# Altium schematic sheet 15.SchDoc
size 420 x 297 mm
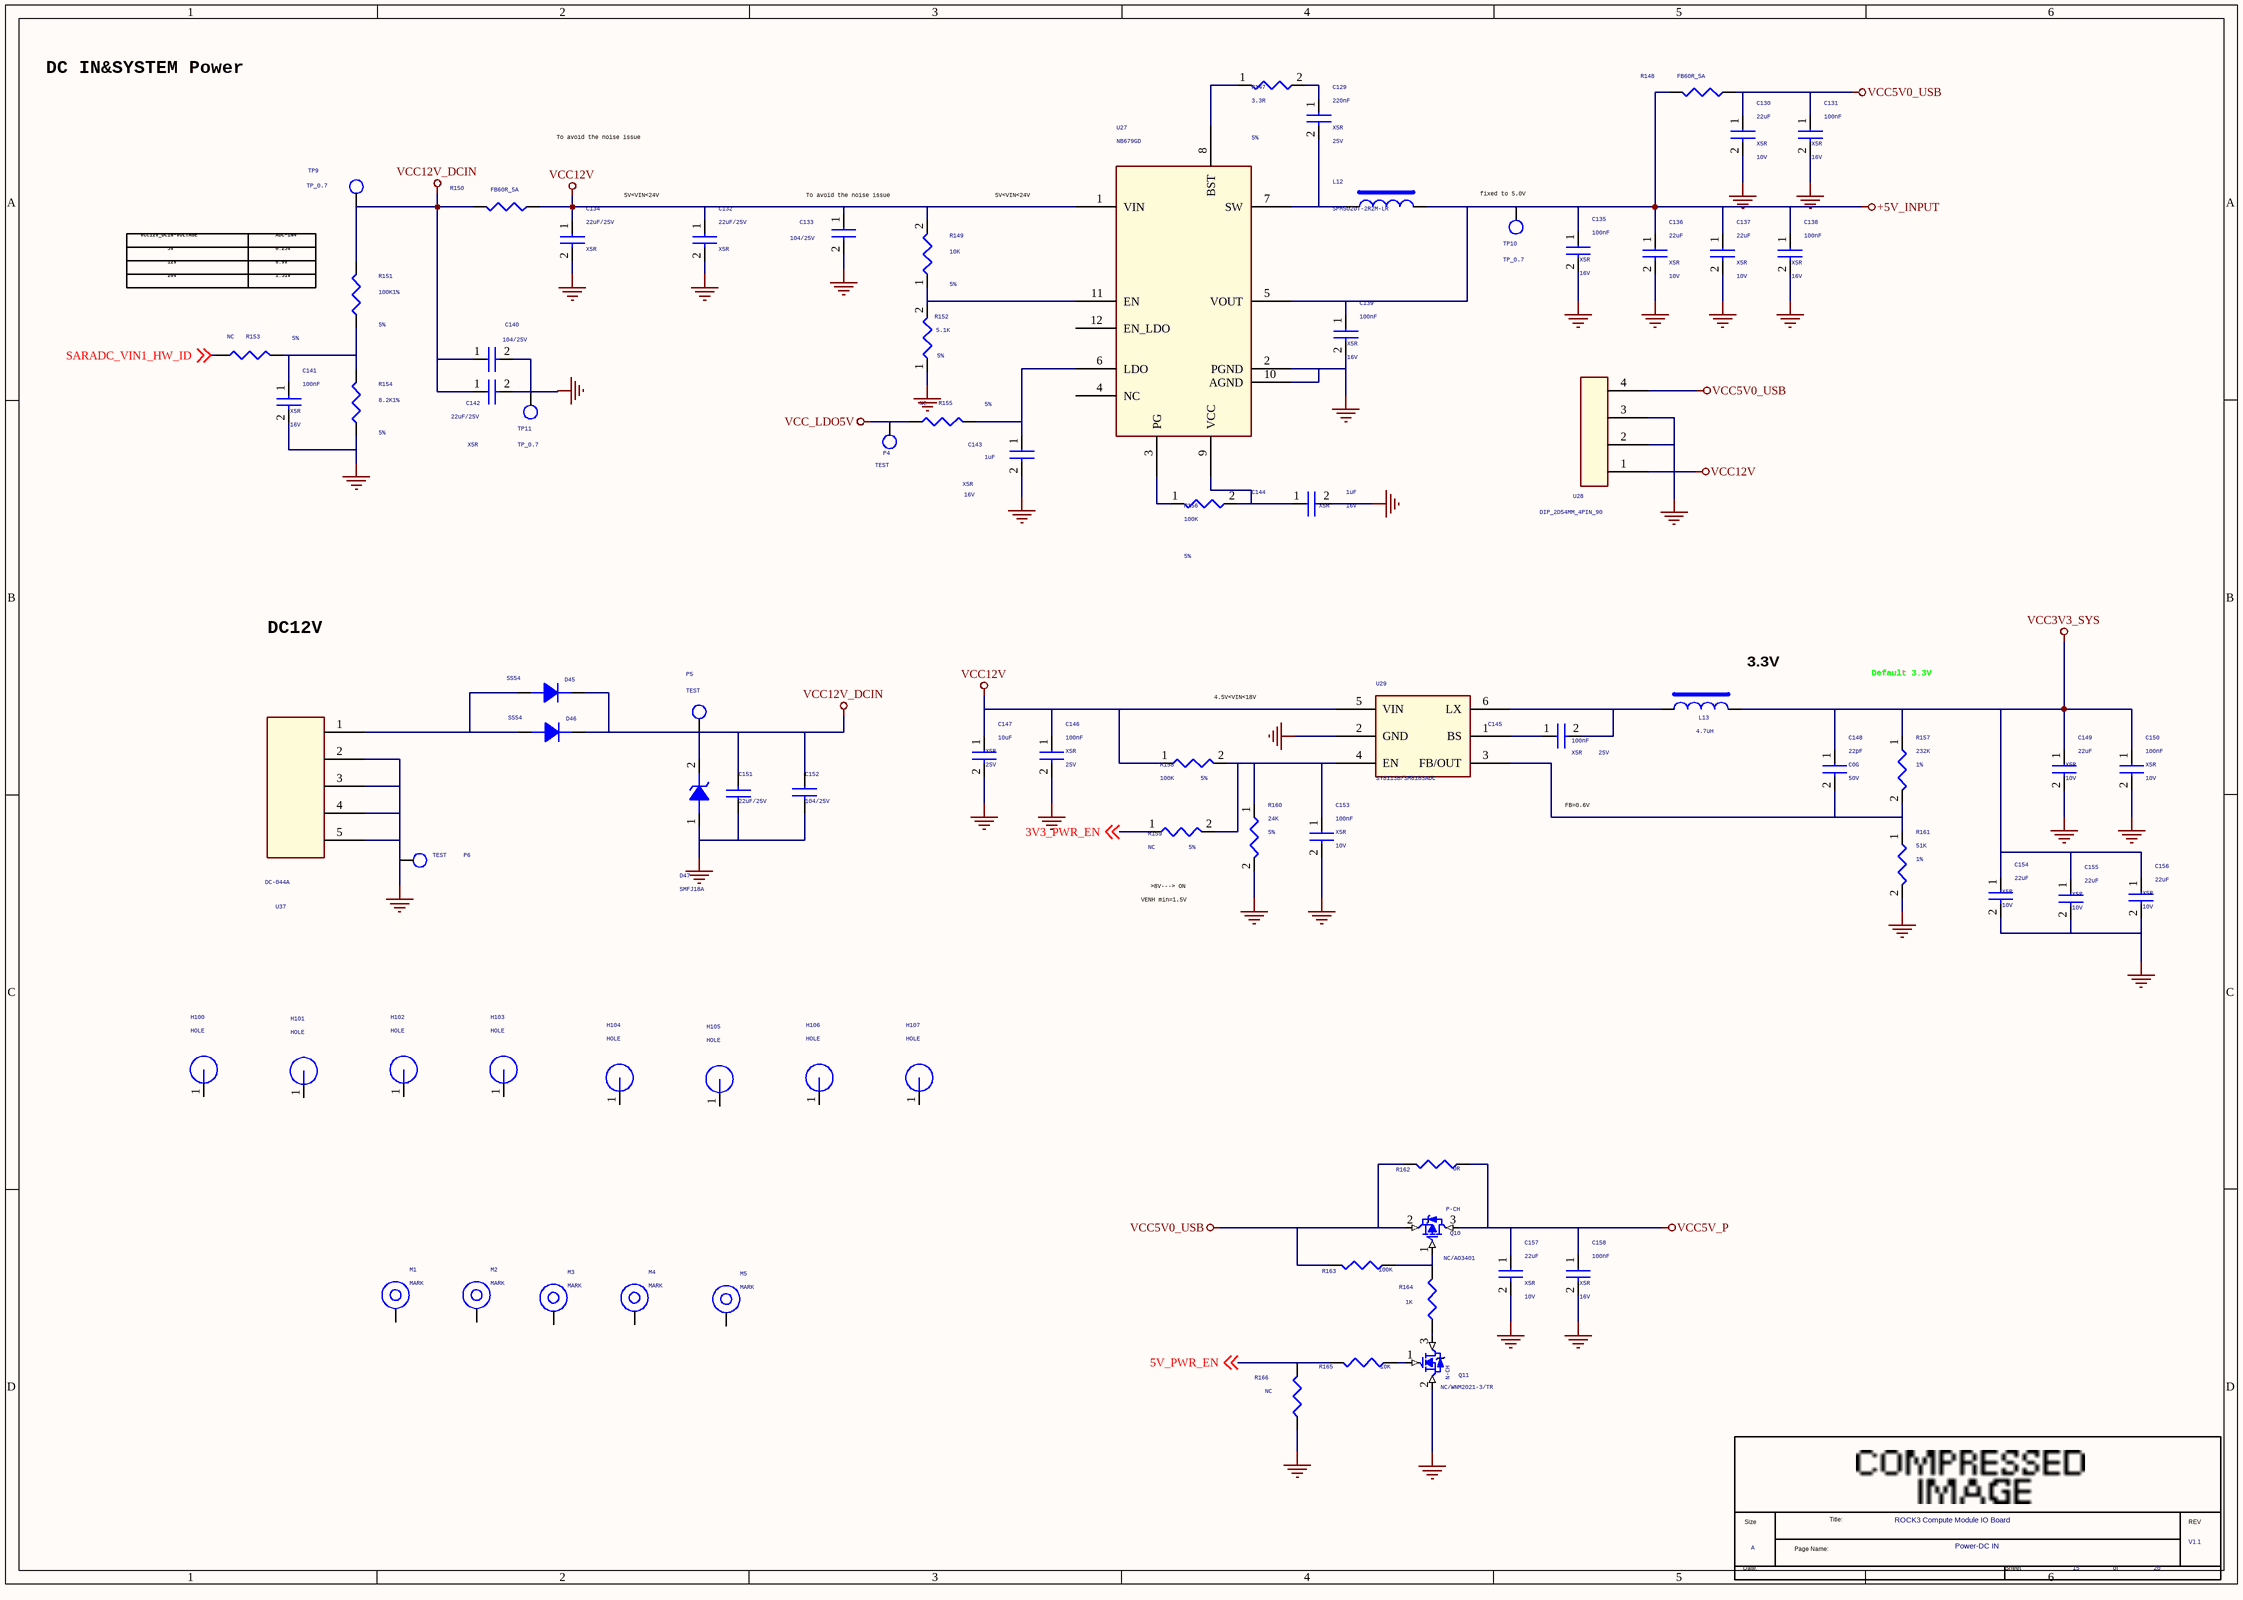
[diagram p0: 15.SchDoc]

## Parts
*  Page Count: 20  Page Number: 15  Page Size: A  Title: ROCK3 Compute Module IO Board  RevCode: V1.1  Doc: Power-DC IN  (hidden comment: radxa_gong)  (graphical)
C129  220nF  Voltage: 25V  Dielectric: X5R  [C0402]
C130  22uF  Voltage: 10V  Dielectric: X5R  [C0603]
C131  100nF  Voltage: 16V  Dielectric: X5R  [C0402]
C132  22uF/25V  Dielectric: X5R  [C0805]
C133  104/25V  [C0402]
C134  22uF/25V  Dielectric: X5R  [C0805]
C135  100nF  Voltage: 16V  Dielectric: X5R  [C0402]
C136  22uF  Voltage: 10V  Dielectric: X5R  [C0603]
C137  22uF  Voltage: 10V  Dielectric: X5R  [C0603]
C138  100nF  Voltage: 16V  Dielectric: X5R  [C0402]
C139  100nF  Voltage: 16V  Dielectric: X5R  [C0402]
C140  104/25V  [C0402]
C141  100nF  Voltage: 16V  Dielectric: X5R  [C0402]
C142  22uF/25V  Dielectric: X5R  [C0805]
C143  1uF  Voltage: 16V  Dielectric: X5R  [C0402]
C144  1uF  Voltage: 16V  Dielectric: X5R  [C0402]
C145  100nF  Voltage: 25V  Dielectric: X5R  [C0402]
C146  100nF  Voltage: 25V  Dielectric: X5R  [C0402]
C147  10uF  Voltage: 25V  Dielectric: X5R  [C1206]
C148  22pF  Voltage: 50V  Dielectric: C0G  [C0402]
C149  22uF  Voltage: 10V  Dielectric: X5R  [C0805]
C150  100nF  Voltage: 10V  Dielectric: X5R  [C0402]
C151  22uF/25V  [C0805]
C152  104/25V  [C0402]
C153  100nF  Voltage: 10V  Dielectric: X5R  [C0402]
C154  22uF  Voltage: 10V  Dielectric: X5R  [C0805]
C155  22uF  Voltage: 10V  Dielectric: X5R  [C0805]
C156  22uF  Voltage: 10V  Dielectric: X5R  [C0805]
C157  22uF  Voltage: 10V  Dielectric: X5R  [C0603]
C158  100nF  Voltage: 16V  Dielectric: X5R  [C0402]
D45  SS54  [DO_214AC]
D46  SS54  [DO_214AC]
D47  SMFJ18A  [SOD_123]
H100  HOLE  [H3.8MM]
H101  HOLE  [H3.8MM]
H102  HOLE  [H3.8MM]
H103  HOLE  [H3.8MM]
H104  HOLE  [H3.8MM]
H105  HOLE  [H3.8MM]
H106  HOLE  [H3.8MM]
H107  HOLE  [H3.8MM]
L12  SPM5020T-2R2M-LR  [IND-5020]
L13  4.7uH  [IND-5020]
M1  MARK  [MARK]
M2  MARK  [MARK]
M3  MARK  [MARK]
M4  MARK  [MARK]
M5  MARK  [MARK]
P4  TEST  [TEST]
P5  TEST  [TEST]
P6  TEST  [TEST]
Q10  NC/AO3401  [S0T-23]
Q11  NC/WNM2021-3/TR  [S0T-23]
R147  3.3R  Tolerance: 5%  [R0402]
R148  FB60R_5A  [R1206]
R149  10K  Tolerance: 5%  [R0402]
R150  FB60R_5A  [R1206]
R151  100K1%  Tolerance: 5%  [R0402]
R152  5.1K  Tolerance: 5%  [R0402]
R153  NC  Tolerance: 5%  [R0402]
R154  8.2K1%  Tolerance: 5%  [R0402]
R155  NC  Tolerance: 5%  [R0402]
R156  100K  Tolerance: 5%  [R0402]
R157  232K  Tolerance: 1%  [R0402]
R158  100K  Tolerance: 5%  [R0402]
R159  NC  Tolerance: 5%  [R0402]
R160  24K  Tolerance: 5%  [R0402]
R161  51K  Tolerance: 1%  [R0402]
R162  0R  [R0603]
R163  100K  [R0402]
R164  1K  [R0402]
R165  10K  [R0402]
R166  NC  [R0402]
TP9  TP_0.7  [TEST]
TP10  TP_0.7  [TEST]
TP11  TP_0.7  [TEST]
U27  NB679GD  [QFN12_3R00X2R00X0R90]
U28  DIP_2D54MM_4PIN_90  [XIAO_4PIN_2D54]
U29  SY8113B/SM8103ADC  [SOT_23_6]
U37  DC-044A  [DC-044A]

## Nets
+5V_INPUT: C135.1 C136.1 C137.1 C138.1 C139.1 L12.2 R148.2 TP10.1 U27.5(VOUT)
GND: C130.2 C131.2 C132.2 C133.2 C134.2 C135.2 C136.2 C137.2 C138.2 C139.2 C140.2 C141.2 C142.2 C143.2 C144.2 C146.2 C147.2 C149.2 C150.2 C151.1 C152.2 C153.2 C154.2 C155.2 C156.2 C157.2 C158.2 D47.1(ANODE) P6.1 Q11.2(S) R152.1 R154.1 R160.2 R161.2 R166.2 TP11.1 U27.2(PGND) U27.10(AGND) U28.2 U28.3 U29.2(GND) U37.2 U37.3 U37.4 U37.5
VCC3V3_SYS: C148.1 C149.1 C150.1 C154.1 C155.1 C156.1 L13.2 R157.1
VCC5V0_USB: C130.1 C131.1 Q10.2(S) R148.1 R162.2 R163.2 U28.4
VCC5V_P: C157.1 C158.1 Q10.3(D) R162.1
VCC12V: C132.1 C133.1 C134.1 C146.1 C147.1 R149.2 R150.1 R158.1 U27.1(VIN) U28.1 U29.5(VIN)
VCC12V_DCIN: C140.1 C142.1 C151.2 C152.1 D45.2(K) D46.2(K) D47.2(CATHODE) P5.1 R150.2 R151.2 TP9.1
VCC_LDO5V: P4.1 R155.1
3V3_PWR_EN: R159.1 ; off-sheet 3V3_PWR_EN
5V_PWR_EN: R165.2 R166.1 ; off-sheet 5V_PWR_EN
SARADC_VIN1_HW_ID: R153.1 ; off-sheet SARADC_VIN1_HW_ID
NetC129_1: C129.1 R147.2
NetC129_2: C129.2 L12.1 U27.7(SW)
NetC141_1: C141.1 R151.1 R153.2 R154.2
NetC143_1: C143.1 R155.2 U27.6(LDO)
NetC144_1: C144.1 R156.2 U27.9(VCC)
NetC145_1: C145.1 U29.1(BS)
NetC145_2: C145.2 L13.1 U29.6(LX)
NetC148_2: C148.2 R157.2 R161.1 U29.3(FB/OUT)
NetC153_1: C153.1 R158.2 R159.2 R160.1 U29.4(EN)
NetD45_1: D45.1(A) D46.1(A) U37.1
NetQ10_1: Q10.1(G) R163.1 R164.1
NetQ11_1: Q11.1(G) R165.1
NetQ11_3: Q11.3(D) R164.2
NetR147_1: R147.1 U27.8(BST)
NetR149_1: R149.1 R152.2 U27.11(EN)
NetR156_1: R156.1 U27.3(PG)

Not connected (* = marked no-connect by the designer): H100 1; H101 1; H102 1; H103 1; H104 1; H105 1; H106 1; H107 1; M1 1; M2 1; M3 1; M4 1; M5 1; U27 4(NC) 12(EN_LDO)

## Notes on the sheet
- DC IN&SYSTEM Power
- To avoid the noise issue
- (near TP10) fixed to 5.0V
- VCC12V_DCIN-VOLTAGE
- 5V
- 12V
- ADC-IN4
- 0.25V
- 0.9V
- 5V<VIN<24V
- (near C133) To avoid the noise issue
- 20V
- 1.51V
- DC12V
- (near L13) 3.3V
- 4.5V<VIN<18V
- Default 3.3V
- FB=0.6V
- VENH min=1.5V
- >8V---> ON
- (in symbol N-MOSFET) N-CH
- (in symbol P-MOSFET) P-CH
- (in symbol radxa_gong) Title:; Size; REV; Page Name:; Date:; Sheet; of

## Library data of the parts
C129 = CAP NP_Dup2: cap,220.00nF,+/-10%,25V,X5R,C0402; Manufacturer: TDK; RK PN: C1005X5R1E224K050BC; Priority: A; Tolerance: 10%; Part Type: C0402; Manufacturer PN: C1005X5R1E224K050BC; Created by: JJJ
C130 C136 C137 = CAP NP_Dup2: cap,22.00uF,+/-10%,10V,X5R,C0805; Manufacturer PN: C2012X5R1A226K125AB; Manufacturer: TDK; Tolerance: 10%; Priority: A; Created by: JJJ; Part Type: C0805; RK PN: C2012X5R1A226K125AB
C131 C135 C138 C139 C158 = CAP NP_Dup2: cap,100.00nF,+/-10%,16V,X5R,C0402; Manufacturer: TDK; RK PN: C1005X5R1C104K050BA; Priority: A; Tolerance: 10%; Part Type: C0402; Manufacturer PN: C1005X5R1C104K050BA; Created by: JJJ
C132 C142 = CAP NP_Dup2: cap,10.00uF,+/-10%,16V,X5R,C0805; Manufacturer PN: C2012X5R1C106K125AC; Manufacturer: TDK; Tolerance: 10%; Priority: A; Voltage: 16V; Created by: JJJ; Part Type: C0805; RK PN: C2012X5R1C106K125AC
C133 C140 = CAP NP_Dup2: cap,1.00uF,+/-10%,16V,X5R,C0402; Manufacturer: TDK; Voltage: 25V; RK PN: C1005X5R1C105K050BC; Priority: A; Tolerance: 10%; Dielectric: X5R; Part Type: C0402; Manufacturer PN: C1005X5R1C105K050BC; Created by: JJJ
C134 = CAP NP_Dup2: cap,10.00uF,+/-10%,16V,X5R,C0805; Manufacturer: TDK; RK PN: C2012X5R1C106K125AC; Priority: A; Tolerance: 10%; Voltage: 16V; Part Type: C0805; Manufacturer PN: C2012X5R1C106K125AC; Created by: JJJ
C141 = CAP NP_Dup2: cap,100.00nF,+/-10%,16V,X5R,C0402; Manufacturer PN: C1005X5R1C104K050BA; Manufacturer: TDK; Tolerance: 10%; Priority: A; Created by: JJJ; Part Type: C0402; RK PN: C1005X5R1C104K050BA
C143 C144 = CAP NP_Dup2: cap,1.00uF,+/-10%,16V,X5R,C0402; Manufacturer: TDK; RK PN: C1005X5R1C105K050BC; Priority: A; Tolerance: 10%; Part Type: C0402; Manufacturer PN: C1005X5R1C105K050BC; Created by: JJJ
C145 = CAP NP_Dup2: cap,100.00nF,+/-10%,25V,X5R,C0402; Manufacturer: TDK; Number: 37; RK PN: C1005X5R1E104K050BC; Priority: A; Tolerance: 10%; C_Voltage: 6.3V; Part Type: C0402; Manufacturer PN: C1005X5R1E104K050BC; Created by: JJJ
C146 = CAP NP_Dup2: cap,100.00nF,+/-10%,25V,X5R,C0402; Manufacturer: TDK; RK PN: C1005X5R1E104K050BC; Priority: A; Tolerance: 10%; Part Type: C0402; Manufacturer PN: C1005X5R1E104K050BC; Created by: JJJ
C147 = CAP NP_Dup2: cap,10.00uF,+/-10%,25V,X5R,C1206; Manufacturer PN: C3216X5R1E106K085AC; Manufacturer: TDK; Tolerance: 10%; C_Voltage: 6.3V; Priority: A; Created by: JJJ; Part Type: C1206; RK PN: C3216X5R1E106K085AC
C148 = CAP NP_Dup2: cap,22.00pF,+/-5%,50V,C0G,C0402; Manufacturer: TDK; RK PN: C1005C0G1H220J050BA; Priority: A; Tolerance: 5%; Part Type: C0402; Manufacturer PN: C1005C0G1H220J050BA; Created by: JJJ
C149 C155 C156 = CAP NP_Dup2: cap,22.00uF,+/-10%,10V,X5R,C0805; Manufacturer: TDK; RK PN: C2012X5R1A226K125AB; Priority: A; C_Voltage: 6.3V; Tolerance: 10%; Part Type: C0805; Manufacturer PN: C2012X5R1A226K125AB; Created by: JJJ
C150 C153 = CAP NP_Dup2: cap,100.00nF,+/-10%,10V,X5R,C0402; Manufacturer: TDK; Number: 37; RK PN: C1005X5R1A104K050BA; Priority: A; Tolerance: 10%; C_Voltage: 6.3V; Part Type: C0402; Manufacturer PN: C1005X5R1A104K050BA; Created by: JJJ
C151 = CAP NP_4
C152 = CAP NP_Dup1: CAP,MLCC,1nF,+/-10%,X5R,6.3V,SMD0402; ROOM: USB+5V; MARK: 22P
C154 = CAP NP_Dup2: cap,22.00uF,+/-10%,10V,X5R,C0805; Manufacturer PN: C2012X5R1A226K125AB; Manufacturer: TDK; Tolerance: 10%; C_Voltage: 6.3V; Priority: A; Created by: JJJ; Part Type: C0805; RK PN: C2012X5R1A226K125AB
C157 = CAP NP_Dup2: cap,22.00uF,+/-10%,10V,X5R,C0805; Manufacturer: TDK; RK PN: C2012X5R1A226K125AB; Priority: A; Tolerance: 10%; Part Type: C0805; Manufacturer PN: C2012X5R1A226K125AB; Created by: JJJ
D45 = DIODE_Dup1: Schottky Barrier，SS32 DO214AC; Manufacturer PN: SS32; Manufacturer: 星海; Priority: A; ROOM: CHG; Created by: JJJ; Part Type: Schottky rectifier; RK PN: SS32
D46 = DIODE_Dup1: Schottky Barrier，SS32 DO214AC; Manufacturer: 星海; ROOM: CHG; RK PN: SS32; Priority: A; Part Type: Schottky rectifier; Manufacturer PN: SS32; Created by: JJJ
D47 = DIODE ZENER1: 1-Line, Uni-directional, Transient Voltage Suppressor; Manufacturer: WillSemi(韦尔半导体); RK PN: ESD5621W-2/TR; Priority: A; Part Type: ESD_TVS; Manufacturer PN: ESD5621W-2/TR; Created by: JJJ
H100-H107 = HOLE: 直径3.5mm hole; Priority: A; RK PN: HOLE_3R50; Created by: CZD; Part Type: HOLE
L12 = INDUCTORS OF FERRITE
L13 = INDUCTORS OF FERRITE_Dup1: Power Inductor,4.7uH,0.2,IND_606045; Manufacturer: sunlord; DC Resistor: 0.02ohm; Isat: 4.97A; RK PN: SWPA6045S4R7MT; Priority: A; Tolerance: 20%; Irms: 3.3A; Resonace frequency: 24M; Part Type: POWER_IND; Manufacturer PN: SWPA6045S4R7MT; Created by: YWQ
M1 M4 = MARK: MARK Symble; RK PN: MARK01; Priority: A; Part Type: MARK; Created by: JJJ
M2 M3 M5 = MARK: MARK Symble; Priority: A; RK PN: MARK01; Created by: JJJ; Part Type: MARK
P4-P6 = TESTPOINT1
Q10 = P-MOSFET: SANZ_P/N: SK2301; Part Type: MOS管
Q11 = N-MOSFET: SANZ_P/N: SK2300; Part Type: MOS管
R147 = RESISTOR_Dup1: 通用厚膜电阻,3R3,+/-5%,R0402,1/16W.; Manufacturer: YAGEO; RK PN: RC0402JR-073R3L; Priority: A; Wattage: 1/16W; Part Type: 通用厚膜电阻; Manufacturer PN: RC0402JR-073R3L; Created by: YTL
R148 R150 = R_0
R149 R152 = RESISTOR_Dup1: 通用厚膜电阻,10K,+/-5%,R0402,1/16W.; Manufacturer PN: RC0402JR-0710KL; Manufacturer: YAGEO; Wattage: 1/16W; Priority: A; Created by: YTL; Part Type: 通用厚膜电阻; RK PN: RC0402JR-0710KL
R151 R155 = RESISTOR_2: 通用厚膜电阻,10K,+/-5%,R0402,1/16W.; Manufacturer PN: RC0402JR-0710KL; Manufacturer: YAGEO; Wattage: 1/16W; Priority: A; Created by: YTL; Part Type: 通用厚膜电阻; RK PN: RC0402JR-0710KL
R153 R154 = RESISTOR_2: 通用厚膜电阻,10K,+/-5%,R0402,1/16W.; Manufacturer: YAGEO; RK PN: RC0402JR-0710KL; Priority: A; Wattage: 1/16W; Part Type: 通用厚膜电阻; Manufacturer PN: RC0402JR-0710KL; Created by: YTL
R156 R159 = RESISTOR_Dup1: 通用厚膜电阻,100K,+/-5%,R0402,1/16W.; Manufacturer: YAGEO; RK PN: RC0402JR-07100KL; Priority: A; Wattage: 1/16W; Part Type: 通用厚膜电阻; Manufacturer PN: RC0402JR-07100KL; Created by: YTL
R157 = RESISTOR_Dup1: 通用厚膜电阻,232K,+/-1%,R0402,1/16W.; Manufacturer: YAGEO; RK PN: RC0402FR-07232KL; Priority: A; Wattage: 1/16W; Part Type: 通用厚膜电阻; Manufacturer PN: RC0402FR-07232KL; Created by: YTL
R158 = RESISTOR_Dup1: 通用厚膜电阻,100K,+/-5%,R0402,1/16W.; Manufacturer PN: RC0402JR-07100KL; Manufacturer: YAGEO; Wattage: 1/16W; Priority: A; Created by: YTL; Part Type: 通用厚膜电阻; RK PN: RC0402JR-07100KL
R160 = RESISTOR_Dup1: 通用厚膜电阻,24K,+/-5%,R0402,1/16W.; Manufacturer PN: RC0402JR-0724KL; Manufacturer: YAGEO; Wattage: 1/16W; Priority: A; Created by: YTL; Part Type: 通用厚膜电阻; RK PN: RC0402JR-0724KL
R161 = RESISTOR_Dup1: 通用厚膜电阻,49K9,+/-1%,R0402,1/16W.; Manufacturer: YAGEO; RK PN: RC0402FR-0749K9L; Priority: A; Wattage: 1/16W; Part Type: 通用厚膜电阻; Manufacturer PN: RC0402FR-0749K9L; Created by: YTL
R162 R163 R165 = RESISTOR_1: RES,thick film,47KOhm,+/-5%,1/16W,SMD0402
R164 R166 = RESISTOR_0: RES,thick film,47KOhm,+/-5%,1/16W,SMD0402; MARK: 51K
TP9 TP11 = TP: Test Point 0.7mm; Priority: A; RK PN: TESTPOINT_0R7; Created by: JJJ; Part Type: TP
TP10 = TP: Test Point 0.7mm; RK PN: TESTPOINT_0R7; Priority: A; Part Type: TP; Created by: JJJ
U27 = DCDC_NB679: 26 V, Low Iq, High Current, Fixed 5 V-8 A Synchronous Buck Converter with 100 mA LDO;; Manufacturer: MPS （美国芯源）; RK PN: NB679GD; Priority: A; Part Type: DCDC; Manufacturer PN: NB679GD; Created by: JJJ
U28 = CON3_2
U29 = DCDC_SY8113: Manufacturer: Silergy（矽力杰）; Priority: A; Created by: JJJ; Manufacturer PN: SY8113B; Part Type: DCDC; RK PN: SY8113B
U37 = CON3_6
* = radxa_gong: Page Create Date: March  8, 1995